# Altium schematic sheet PROC099B_SOP_Headers_Reference.SchDoc
size 431 x 279 mm; Date: Not shown in title block; ApprovedBy: Not shown in title block; CheckedBy: Not shown in title block; Author: Not shown in title block; CompanyName: Not shown in title block; DrawnBy: Adrian Ozer; Engineer: Not shown in title block; Organization: Not shown in title block; Address1: Not shown in title block; Address2: Not shown in title block; Address3: Not shown in title block; Address4: Not shown in title block; DocumentNumber: 6; Revision: Use project parameter SCH_Rev; SheetNumber: 6; SheetTotal: 16; PageSetup: Record=PageOptions|CenterHorizontal=True|CenterVertical=True|PrintScale=1.00|XCorrection=1.00|YCorrection=1.00|PrintKind=0|BorderSize=5000000|LeftOffset=0|BottomOffset=0|Orientation=2|PaperLength=1000|PaperWidth=1000|Scale=100|PaperSource=15|PrintQuality=600|MediaType=1|DitherType=10|PaperKind=Letter|PrintScaleMode=1; CurrentTime: Not shown in title block; CurrentDate: Not shown in title block; Time: Not shown in title block; DocumentFullPathAndName: Not shown in title block; DocumentName: Not shown in title block; ModifiedDate: Not shown in title block; ImagePath: Not shown in title block
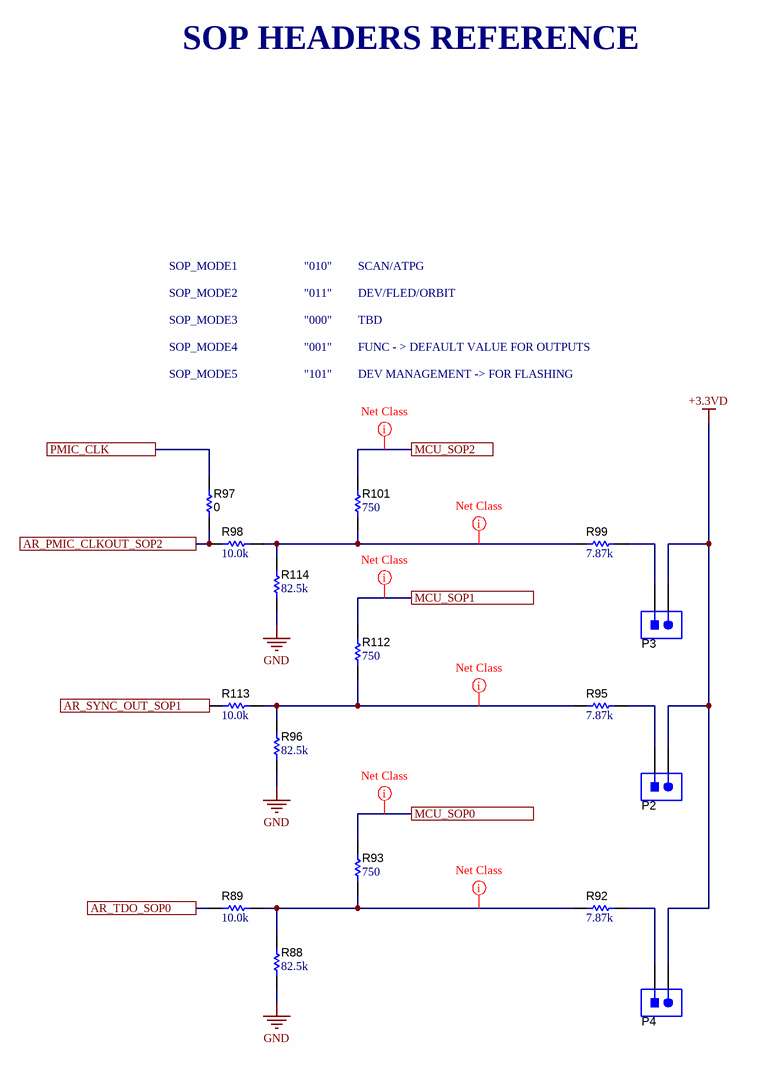
[diagram p0: PROC099B_SOP_Headers_Reference.SchDoc]

## Parts
P2  TSW-102-07-G-S  [TSW-102-07-G-S]  (value not drawn)
P3  TSW-102-07-G-S  [TSW-102-07-G-S]  (value not drawn)
P4  TSW-102-07-G-S  [TSW-102-07-G-S]  (value not drawn)
R88  ValueDisplayed: 82.5k  [0402L]  (hidden comment: CRCW040282K5FKED)
R89  ValueDisplayed: 10.0k  [0402L]  (hidden comment: CRCW040210K0FKED)
R92  ValueDisplayed: 7.87k  [0402L]  (hidden comment: CRCW04027K87FKED)
R93  ValueDisplayed: 750  [0402L]  (hidden comment: CRCW0402750RFKED)
R95  ValueDisplayed: 7.87k  [0402L]  (hidden comment: CRCW04027K87FKED)
R96  ValueDisplayed: 82.5k  [0402L]  (hidden comment: CRCW040282K5FKED)
R97  ValueDisplayed: 0  [0402L]  (hidden comment: ERJ-2GE0R00X)
R98  ValueDisplayed: 10.0k  [0402L]  (hidden comment: CRCW040210K0FKED)
R99  ValueDisplayed: 7.87k  [0402L]  (hidden comment: CRCW04027K87FKED)
R101  ValueDisplayed: 750  [0402L]  (hidden comment: CRCW0402750RFKED)
R112  ValueDisplayed: 750  [0402L]  (hidden comment: CRCW0402750RFKED)
R113  ValueDisplayed: 10.0k  [0402L]  (hidden comment: CRCW040210K0FKED)
R114  ValueDisplayed: 82.5k  [0402L]  (hidden comment: CRCW040282K5FKED)

## Ports
AR_PMIC_CLKOUT_SOP2, AR_SYNC_OUT_SOP1, AR_TDO_SOP0, MCU_SOP0, MCU_SOP1, MCU_SOP2, PMIC_CLK

## Nets
+3.3VD: P2.2 P3.2 P4.2
GND: R88.1 R96.1 R114.1
AR_PMIC_CLKOUT_SOP2: R97.1 R98.1 ; port AR_PMIC_CLKOUT_SOP2
AR_SYNC_OUT_SOP1: R113.1 ; port AR_SYNC_OUT_SOP1
AR_TDO_SOP0: R89.1 ; port AR_TDO_SOP0
MCU_SOP0: R93.2 ; port MCU_SOP0
MCU_SOP1: R112.2 ; port MCU_SOP1
MCU_SOP2: R101.2 ; port MCU_SOP2
PMIC_CLK: R97.2 ; port PMIC_CLK
NetP2_1: P2.1 R95.2
NetP3_1: P3.1 R99.2
NetP4_1: P4.1 R92.2
NetR88_2: R88.2 R89.2 R92.1 R93.1
NetR95_1: R95.1 R96.2 R112.1 R113.2
NetR98_2: R98.2 R99.1 R101.1 R114.2

## Layout directives
net class GENERAL: MCU_SOP0, MCU_SOP1, MCU_SOP2, NetR88_2, NetR95_1, NetR98_2

## Notes on the sheet
- SOP HEADERS REFERENCE
- SOP_MODE1
- "010"
- SCAN/ATPG
- SOP_MODE2
- SOP_MODE3
- "011"
- "000"
- DEV/FLED/ORBIT
- TBD
- SOP_MODE4
- SOP_MODE5
- "001"
- "101"
- FUNC - > DEFAULT VALUE FOR OUTPUTS
- DEV MANAGEMENT -> FOR FLASHING
- Drawn By:
- SVN Rev:
- Number:
- TID #:
- Orderable:
- Rev:
- Sheet Title:
- File:
- Project Title:
- Designed for:
- Assembly Variant:
- Mod. Date:
- Sheet:
- Size:
- of
- B
- http://www.ti.com
- Texas Instruments and/or its licensors do not warrant the accuracy or completeness of this specification or any information contained therein. Texas Instruments and/or its licensors do not warrant that this design will meet the specifications, will be suitable for your application or fit for any particular purpose, or will operate in an implementation. Texas Instruments and/or its licensors do not warrant that the design is production worthy. You should completely validate and test your design implementation to confirm the system functionality for your application.
- Engineer:
- Contact:
- © Texas Instruments

## Library data of the parts
P2-P4 = CMP-0075405-2: Header, 100mil, 2x1, Gold, TH; Manufacturer: Samtec; Pitch_mm: 2.54; Cert_VDE: N; Gender: Male; Cert_CSA: Y; Voltage_V: 550V; Green_REACh: Passed; Current_A: 6.3A; Green_Lifecycle: Active; Row_Count: 1; ComponentLink1Description: Datasheet URL; RoHS: Y; Supplier 1: Digi-Key; Cert_UL: Y; Orientation: Vertical; Green_EU RoHS: Passed; PackageReference: 2x1 Header; Color: Black; PartNumber: TSW-102-07-G-S; PinCount: 2; ContactFinish: Gold; Cert_CULUS: N; Shrouded: N; ClassName: Header; ComponentLink1URL: http://samtec.com/ftppub/pdf/TSW_TH.PDF; CompType: Header; MountType: TH; Supplier Part Number 1: SAM1029-02-ND; Green_EU RoHS-2: Passed
R88 R96 = CMP-0026574-2: RES, 82.5 k, 1%, 0.063 W, AEC-Q200 Grade 0, 0402; Manufacturer: Vishay-Dale; Power_W: 63mW; TempCo: 100 ppm/C; Value_Code: 82k5; Value: 82.5k; EIA_Code: E96; SizeX_mm: 1; SizeY_mm: 0.5; SizeZ_mm: 0.6; Value2: 0.063W; AEC Qualified: Y; VDC_V: 50V; AEC Grade: 0; AEC Category: Q200; ComponentLink1URL: http://www.vishay.com/docs/20035/dcrcwe3.pdf; Supplier Part Number 2: 52K7304; Supplier 2: Newark; Supplier Part Number 3: 71-CRCW0402-82.5K-E3; Supplier 3: Mouser; RoHS: E; Value1: 1%; MountType: SMT; Supplier 1: Digi-Key; PackageReference: 0402; Tolerance_%: 1%; Res_ohm: 82.5k; SizeArea_mm2: 0.5; CompType: Resistor; PartNumber: CRCW040282K5FKED; ComponentLink1Description: Datasheet link; Supplier Part Number 1: 541-82.5KLCT-ND; Technology: Thick Film
R89 R98 R113 = CMP-0025958-3: RES, 10.0 k, 1%, 0.063 W, AEC-Q200 Grade 0, 0402; Manufacturer: Vishay-Dale; Power_W: 63mW; TempCo: 100 ppm/C; Value_Code: 10k0; Value: 10.0k; EIA_Code: E96; Res_ohm: 10k; SizeX_mm: 1; SizeY_mm: 0.5; SizeZ_mm: 0.6; Value2: 0.063W; CompType: Resistor; AEC Qualified: Y; VDC_V: 50V; AEC Category: Q200; AEC Grade: 0; Supplier Part Number 2: 52K6595; Supplier 2: Newark; Supplier Part Number 3: 71-CRCW0402-10K-E3; Supplier 3: Mouser; RoHS: E; Value1: 1%; MountType: SMT; Supplier 1: Digi-Key; PackageReference: 0402; Tolerance_%: 1%; SizeArea_mm2: 0.5; PartNumber: CRCW040210K0FKED; ComponentLink1Description: Datasheet link; Supplier Part Number 1: 541-10.0KLCT-ND; Technology: Thick Film; ComponentLink1URL: http://www.vishay.com/docs/20035/dcrcwe3.pdf
R92 R95 R99 = CMP-0026557-2: RES, 7.87 k, 1%, 0.063 W, AEC-Q200 Grade 0, 0402; Manufacturer: Vishay-Dale; Power_W: 63mW; TempCo: 100 ppm/C; Value_Code: 7k87; Value: 7.87k; EIA_Code: E96; SizeX_mm: 1; SizeY_mm: 0.5; SizeZ_mm: 0.6; Value2: 0.063W; AEC Qualified: Y; VDC_V: 50V; AEC Grade: 0; AEC Category: Q200; ComponentLink1URL: http://www.vishay.com/docs/20035/dcrcwe3.pdf; Supplier Part Number 2: 52K7249; Supplier 2: Newark; Supplier Part Number 3: 71-CRCW0402-7.87K-E3; Supplier 3: Mouser; RoHS: E; Value1: 1%; MountType: SMT; Supplier 1: Digi-Key; PackageReference: 0402; Tolerance_%: 1%; Res_ohm: 7.87k; SizeArea_mm2: 0.5; CompType: Resistor; PartNumber: CRCW04027K87FKED; ComponentLink1Description: Datasheet link; Supplier Part Number 1: 541-7.87KLCT-ND; Technology: Thick Film
R93 R112 = CMP-0026542-2: RES, 750, 1%, 0.063 W, AEC-Q200 Grade 0, 0402; Manufacturer: Vishay-Dale; Power_W: 63mW; TempCo: 100 ppm/C; Value_Code: 750R; Value: 750; EIA_Code: E96; SizeX_mm: 1; SizeY_mm: 0.5; SizeZ_mm: 0.6; Value2: 0.063W; AEC Qualified: Y; VDC_V: 50V; AEC Grade: 0; AEC Category: Q200; ComponentLink1URL: http://www.vishay.com/docs/20035/dcrcwe3.pdf; Supplier Part Number 2: 52K7270; Supplier 2: Newark; Supplier Part Number 3: 71-CRCW0402-750-E3; Supplier 3: Mouser; RoHS: E; Value1: 1%; MountType: SMT; Supplier 1: Digi-Key; PackageReference: 0402; Tolerance_%: 1%; Res_ohm: 750; SizeArea_mm2: 0.5; CompType: Resistor; PartNumber: CRCW0402750RFKED; ComponentLink1Description: Datasheet link; Supplier Part Number 1: 541-750LCT-ND; Technology: Thick Film
R97 = CMP-0026992-2: RES, 0, 5%, 0.063 W, 0402; Manufacturer: Panasonic; Power_W: 63mW; TempCo: 600 ppm/C; Value_Code: 0000; U/M: EA; Value: 0; EIA_Code: E24; SizeX_mm: 1; SizeY_mm: 0.5; SizeZ_mm: 0.6; Value2: 0.063W; CompType: Resistor; VDC_V: 50V; AEC Category: Q200; INSTALATION: DNP; Supplier Part Number 2: 65T8307; Publisher: Texas Instruments; Supplier 2: Newark; Supplier Part Number 3: 667-ERJ-2GE0R00X; Supplier 3: Mouser; Published: 2008-06-26; RoHS: Y; Value1: 5%; MountType: SMT; Supplier 1: Digi-Key; PackageReference: 0402; Tolerance_%: 5%; Res_ohm: 0; SizeArea_mm2: 0.5; LatestRevisionDate: 2017-03-09; PartNumber: ERJ-2GE0R00X; AEC Qualified: ?; ComponentLink1Description: Datasheet link; Supplier Part Number 1: P0.0JCT-ND; Technology: Thick Film; ComponentLink1URL: http://www.panasonic.com/industrial/components/pdf/AOA0000CE1.pdf
R101 = CMP-0026542-2: RES, 750, 1%, 0.063 W, AEC-Q200 Grade 0, 0402; Manufacturer: Vishay-Dale; Power_W: 63mW; TempCo: 100 ppm/C; Value_Code: 750R; Value: 750; EIA_Code: E96; SizeX_mm: 1; SizeY_mm: 0.5; SizeZ_mm: 0.6; Value2: 0.063W; CompType: Resistor; AEC Qualified: Y; VDC_V: 50V; AEC Grade: 0; AEC Category: Q200; ComponentLink1URL: http://www.vishay.com/docs/20035/dcrcwe3.pdf; Supplier Part Number 2: 52K7270; Supplier 2: Newark; Supplier Part Number 3: 71-CRCW0402-750-E3; Supplier 3: Mouser; RoHS: E; Value1: 1%; MountType: SMT; Supplier 1: Digi-Key; PackageReference: 0402; Tolerance_%: 1%; Res_ohm: 750; SizeArea_mm2: 0.5; PartNumber: CRCW0402750RFKED; ComponentLink1Description: Datasheet link; Supplier Part Number 1: 541-750LCT-ND; Technology: Thick Film
R114 = CMP-0026574-2: RES, 82.5 k, 1%, 0.063 W, AEC-Q200 Grade 0, 0402; Manufacturer: Vishay-Dale; Power_W: 63mW; TempCo: 100 ppm/C; Value_Code: 82k5; Value: 82.5k; EIA_Code: E96; SizeX_mm: 1; SizeY_mm: 0.5; SizeZ_mm: 0.6; Value2: 0.063W; CompType: Resistor; AEC Qualified: Y; VDC_V: 50V; AEC Grade: 0; AEC Category: Q200; ComponentLink1URL: http://www.vishay.com/docs/20035/dcrcwe3.pdf; Supplier Part Number 2: 52K7304; Supplier 2: Newark; Supplier Part Number 3: 71-CRCW0402-82.5K-E3; Supplier 3: Mouser; RoHS: E; Value1: 1%; MountType: SMT; Supplier 1: Digi-Key; PackageReference: 0402; Tolerance_%: 1%; Res_ohm: 82.5k; SizeArea_mm2: 0.5; PartNumber: CRCW040282K5FKED; ComponentLink1Description: Datasheet link; Supplier Part Number 1: 541-82.5KLCT-ND; Technology: Thick Film